# Altium project smart-ppe.PrjPcb (part 1 of 3)
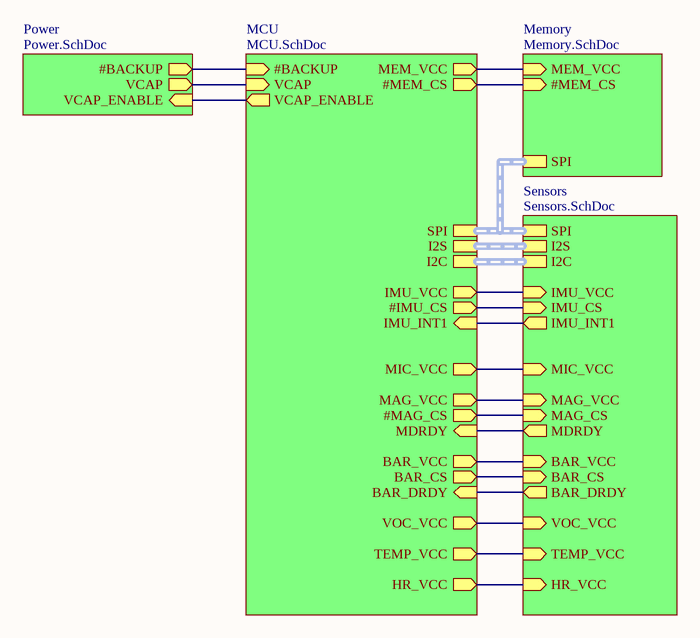
[diagram p0: Top.SchDoc]
Author: Alexander Curtiss; EmailAddress: alexander.curtiss@u.northwestern.edu; Project: Smart PPE
5 sheets, 99 parts. Net scope: hierarchical (ports join the sheet entries above them; power ports are global).
Board file: smart-ppe.PcbDoc
Sheets:
  Top.SchDoc
    MCU = MCU.SchDoc
    Memory = Memory.SchDoc
    Sensors = Sensors.SchDoc
    Power = Power.SchDoc

## Sheet Top.SchDoc: Top
size A; Author: Alexander Curtiss; DocumentNumber: 1; SheetNumber: 1; SheetTotal: 6

### Sub-sheets
MCU = MCU.SchDoc: #MEM_CS (out), MEM_VCC (out), I2S (harness MCU_I2S), IMU_VCC (out), #IMU_CS (out), IMU_INT1 (in), MIC_VCC (out), MAG_VCC (out), #MAG_CS (out), BAR_VCC (out), BAR_CS (out), BAR_DRDY (in), I2C (harness MCU_I2C), VOC_VCC (out), TEMP_VCC (out), #BACKUP (in), SPI (harness MCU_SPI), MDRDY (in), HR_VCC (out), VCAP (in), VCAP_ENABLE (out)
Memory = Memory.SchDoc: SPI (harness MCU_SPI), MEM_VCC (in), #MEM_CS (in)
Power = Power.SchDoc: #BACKUP (out), VCAP (out), VCAP_ENABLE (in)
Sensors = Sensors.SchDoc: IMU_CS (in), MAG_CS (in), IMU_INT1 (out), I2S (harness MCU_I2S), IMU_VCC (in), BAR_VCC (in), SPI (harness MCU_SPI), BAR_DRDY (out), MIC_VCC (in), MAG_VCC (in), BAR_CS (in), I2C (harness MCU_I2C), VOC_VCC (in), TEMP_VCC (in), MDRDY (out), HR_VCC (in)

### Nets
NetC10_1: sheet MCU/MEM_VCC, sheet Memory/MEM_VCC
NetC13_1: sheet MCU/MAG_VCC, sheet Sensors/MAG_VCC
NetC16_1: sheet MCU/IMU_VCC, sheet Sensors/IMU_VCC
NetC19_1: sheet MCU/MIC_VCC, sheet Sensors/MIC_VCC
NetC20_1: sheet MCU/BAR_VCC, sheet Sensors/BAR_VCC
NetC22_1: sheet MCU/TEMP_VCC, sheet Sensors/TEMP_VCC
NetC24_2: sheet MCU/VOC_VCC, sheet Sensors/VOC_VCC
NetC32_1: sheet MCU/HR_VCC, sheet Sensors/HR_VCC
NetD4_5: sheet MCU/#BACKUP, sheet Power/#BACKUP
NetQ3_2: sheet MCU/VCAP_ENABLE, sheet Power/VCAP_ENABLE
NetR18_1: sheet MCU/VCAP, sheet Power/VCAP
NetU1_10: sheet MCU/BAR_CS, sheet Sensors/BAR_CS
NetU1_12: sheet MCU/#MEM_CS, sheet Memory/#MEM_CS
NetU1_27: sheet MCU/MDRDY, sheet Sensors/MDRDY
NetU1_28: sheet MCU/#MAG_CS, sheet Sensors/MAG_CS
NetU1_30: sheet MCU/#IMU_CS, sheet Sensors/IMU_CS
NetU1_41: sheet MCU/IMU_INT1, sheet Sensors/IMU_INT1
NetU1_42: sheet MCU/BAR_DRDY, sheet Sensors/BAR_DRDY

### Buses and harness runs
harness sheet MCU/I2C = sheet Sensors/I2C
harness sheet MCU/I2S = sheet Sensors/I2S
harness sheet MCU/SPI = sheet Memory/SPI = sheet Sensors/SPI

### Notes on the sheet
- Title:
- Sheet
- of
- Project:
- Author:
- Date:
- Variant:
- Ka Moamoa
- Northwestern University
- http://kamoamoa.eecs.northwestern.edu/
- E-Mail:

## Sheet MCU.SchDoc: MCU
size A; Author: Alexander Curtiss; DocumentNumber: 2; SheetNumber: 2; SheetTotal: 6
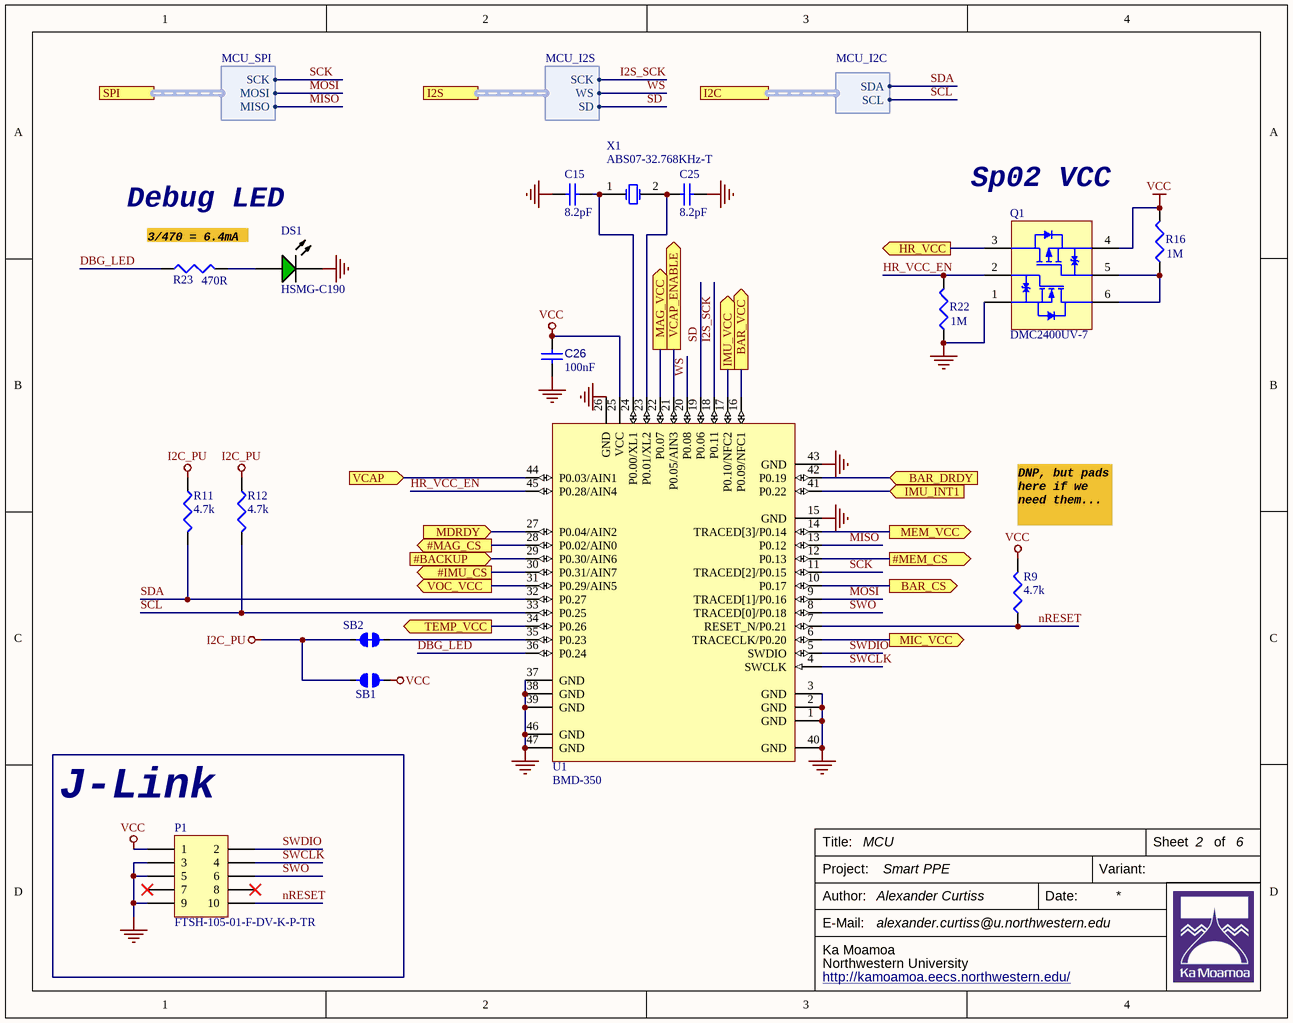
[diagram p1: MCU.SchDoc]

### Parts
C15  8.2pF  [CAPC1005X56X25NL10T15]
C25  8.2pF  [CAPC1005X56X25NL10T15]
C26  value 100nF  [CAPC0402(1005)60_L]  (hidden comment: Capacitor 100nF +/-20% 25V 0402)
DS1  HSMG-C190  [AVAG-HSMX-C190_V]
P1  FTSH-105-01-F-DV-K-P-TR  [FTSH-105-01-F-DV-K-P-TR-Footprint-1]
Q1  DMC2400UV-7  [DIOD-SOT563-6_V]
R9  4.7k  [RESC1608X55X25NL10T15]
R11  4.7k  [RESC1608X55X25NL10T15]
R12  4.7k  [RESC1608X55X25NL10T15]
R16  1M  [RESC1608X55X25NL10T15]
R22  1M  [RESC1608X55X25NL10T15]
R23  470R  [RESC1608X55X25NL10T15]
SB1  Solder Bridge  [Solder Bridge-Footprint-1]  (value not drawn)  (no BOM)
SB2  Solder Bridge NC  [Jumper NC-Footprint-1]  (value not drawn)  (net tie, no BOM)
U1  BMD-350  [BMD_LGA47S_865X640X150_CHIP]
X1  ABS07-32.768KHz-T  [ABRA-ABS07-2_V]

### Blocks framed on the sheet
J-Link: P1

### Ports
#BACKUP (in), #IMU_CS (out), #MAG_CS (out), #MEM_CS (out), BAR_CS (out), BAR_DRDY (in), BAR_VCC (out), HR_VCC (out), I2C (harness MCU_I2C), I2S (harness MCU_I2S), IMU_INT1 (in), IMU_VCC (out), MAG_VCC (out), MDRDY (in), MEM_VCC (out), MIC_VCC (out), SPI (harness MCU_SPI), TEMP_VCC (out), VCAP (in), VCAP_ENABLE (out), VOC_VCC (out)

### Harnesses
MCU_SPI: MISO, MOSI, SCK
MCU_I2S: SD, WS, SCK
MCU_I2C: SCL, SDA

### Nets
GND: C15.1 C25.1 C26.2 DS1.2(K) P1.3 P1.5 P1.9 Q1.1(S1) R22.1 U1.1(GND) U1.2(GND) U1.3(GND) U1.15(GND) U1.26(GND) U1.37(GND) U1.38(GND) U1.39(GND) U1.40(GND) U1.43(GND) U1.46(GND) U1.47(GND)
I2C_PU: R11.2 R12.2 SB1.1 SB2.1
VCC: C26.1 P1.1 Q1.4(S2) R9.2 R16.2 SB1.2 U1.25(VCC)
DBG_LED: R23.1 U1.36(P0.24)
HR_VCC_EN: Q1.2(G1) R22.2 U1.45(P0.28/AIN4)
I2S_SCK: U1.18(P0.11) ; port I2S.SCK
MISO: U1.13(P0.12) ; port SPI.MISO
MOSI: U1.9(TRACED[1]/P0.16) ; port SPI.MOSI
nRESET: P1.10 R9.1 U1.7(RESET_N/P0.21)
SCK: U1.11(TRACED[2]/P0.15) ; port SPI.SCK
SCL: R12.1 U1.33(P0.25) ; port I2C.SCL
SD: U1.19(P0.06) ; port I2S.SD
SDA: R11.1 U1.32(P0.27) ; port I2C.SDA
SWCLK: P1.4 U1.4(SWCLK)
SWDIO: P1.2 U1.5(SWDIO)
SWO: P1.6 U1.8(TRACED[0]/P0.18)
WS: U1.20(P0.08) ; port I2S.WS
NetC10_1: U1.14(TRACED[3]/P0.14) ; port MEM_VCC
NetC13_1: U1.22(P0.07) ; port MAG_VCC
NetC15_2: C15.2 U1.24(P0.00/XL1) X1.1(X1)
NetC16_1: U1.17(P0.10/NFC2) ; port IMU_VCC
NetC19_1: U1.6(TRACECLK/P0.20) ; port MIC_VCC
NetC20_1: U1.16(P0.09/NFC1) ; port BAR_VCC
NetC22_1: U1.34(P0.26) ; port TEMP_VCC
NetC24_2: U1.31(P0.29/AIN5) ; port VOC_VCC
NetC25_2: C25.2 U1.23(P0.01/XL2) X1.2(X2)
NetC32_1: Q1.3(D2) ; port HR_VCC
NetD4_5: U1.29(P0.30/AIN6) ; port #BACKUP
NetDS1_1: DS1.1(A) R23.2
NetQ1_5: Q1.5(G2) Q1.6(D1) R16.1
NetQ3_2: U1.21(P0.05/AIN3) ; port VCAP_ENABLE
NetR18_1: U1.44(P0.03/AIN1) ; port VCAP
NetSB2_2: SB2.2 U1.35(P0.23)
NetU1_10: U1.10(P0.17) ; port BAR_CS
NetU1_12: U1.12(P0.13) ; port #MEM_CS
NetU1_27: U1.27(P0.04/AIN2) ; port MDRDY
NetU1_28: U1.28(P0.02/AIN0) ; port #MAG_CS
NetU1_30: U1.30(P0.31/AIN7) ; port #IMU_CS
NetU1_41: U1.41(P0.22) ; port IMU_INT1
NetU1_42: U1.42(P0.19) ; port BAR_DRDY

Not connected (* = marked no-connect by the designer): P1 7* 8*

### Notes on the sheet
- Debug LED
- 3/470 = 6.4mA
- Sp02 VCC
- (near R9) DNP, but pads here if we need them...
- Title:
- Sheet
- of
- Project:
- Author:
- Date:
- Variant:
- Ka Moamoa
- Northwestern University
- http://kamoamoa.eecs.northwestern.edu/
- E-Mail:

### Library data of the parts
C15 C25 = CMP-2008-02690-1: Part Number: 04025A8R2JAT2A; Manufacturer: AVX Interconnect / Elco
C26 = CMP-001-00065-2: Chip Capacitor, 100nF +/-20%, 25V, 0402, Thickness 0.6 mm; Tolerance: 10%; Pins: 2; Min Operating Temperature: -55°C; Max Operating Temperature: 85°C; Mounting Technology: SMT; Case/Package: 0603; Voltage Rating: 25V
DS1 = CMP-1744-00002-1: Chip LED, Green, 2.2 V, -40 to 85 degC, 2-Pin SMD, RoHS, Tape and Reel; Frequency: 400 KHz; Max Supply Voltage: 5.5 V; Access Time: 3500 ns; Clock Frequency: 100 KHz; Case\Package: SOIC; Density: 32 kb; Nominal Supply Current: 2 mA; Interface: Serial; Min Supply Voltage: 1.7 V; Packaging: Tape and Reel; PackageReference: HSMX-C190; ComponentLink2URL: http://docs.avagotech.com/docs/AV02-0551EN; RoHSCompliant: true; Pins: 8; REACH SVHC: No SVHC; Max Operating Temperature: 85 degC; Width: 4 mm; Radiation Hardening: No; Package Quantity: 3000; ComponentLink3Description: Package Specification; ComponentLink1Description: Manufacturer URL; Min Operating Temperature: -40 degC; PackageDescription: 2-Pin Surface Mount Device, Body 1.6 x 0.8 mm, Height 0.9 mm; Max Clock Frequency: 100 KHz; Height: 1.5 mm; ComponentLink1URL: http://www.avagotech.com/; DatasheetVersion: Mar-12; ComponentLink2Description: Datasheet; Mount: Surface Mount; Length: 5 mm; ComponentLink3URL: http://www.fairchildsemi.com/dwg/MA/MA03D.pdf
P1 = CMP-00000-3: CONN HEADER SMD 10POS 1.27MM; Number of Contacts: 10; Row Spacing: 0.05inch; Connector Type: Male Pin; Housing Color: Black; Housing Material: Polymer; Min Operating Temperature: -55°C; Pitch: 1.27mm; Contact Material: Bronze; Mount: Surface Mount; Color: Black; Number of Rows: 2; Length: 6.35mm; Package Quantity: 500; Lead Free: Lead Free; Packaging: Tape and Reel; Termination: Solder; Contact Mating Length: 0.12inch; Depth: 5.84mm; Max Operating Temperature: 125°C; Contact Plating: Gold; Radiation Hardening: No; Number of Positions: 10; Orientation: Straight
Q1 = CMP-2000-06168-1: Complementary Pair Enhancement Mode MOSFET, 20 V N-Channel, -20 V P-Channel, -55 to 150 degC, 6-Pin SOTFL (SOT563), RoHS, Tape and Reel; Manufacturer: Diodes Inc; Channel Type: N,P; Maximum Power Dissipation: 1W; Typical Gate Charge @ Vgs: 0.5nC@4.5V; Typical Input Capacitance @ Vds: 37.1pF@10V; Maximum Gate Source Voltage: ±12(Q1)V,±8(Q2)V; Maximum Drain Source Resistance: 1.5Ω; Transistor Material: Si; Maximum Continuous Drain Current: 0.7A,1A; Typical Turn-Off Delay Time: 13.74ns; Number of Elements per Chip: 2; Maximum Drain Source Voltage: 20V; Maximum Gate Threshold Voltage: 1V; Transistor Configuration: Isolated; Typical Turn-On Delay Time: 4.06ns; Length: 1.7mm; Height: 0.6mm; Width: 1.25mm; Pin Count: 6; Minimum Operating Temperature: -55°C; Dimensions: 1.7x1.25x0.6mm; Package Type: SOT-563; Category: PowerMOSFET; Maximum Operating Temperature: +150°C; Manufacturer URL: http://www.diodes.com/; Channel Mode: Enhancement; Package Reference: SOT563-6; Mounting Technology: SurfaceMount; Datasheet URL: http://www.diodes.com/_files/datasheets/DMC2400UV.pdf; Package Description: 6-Pin Small Outline Transistor, Flat Lead, Body 1.175 x 1.6 mm, Pitch 0.5 mm; Mounting Type: SurfaceMount; Datasheet Version: Rev. 7-2, 06/2013
R9 R11 R12 = CMP-009-00177-2: Resistor 4.7kΩ 1% 0603; Manufacturer 1: Panasonic; Manufacturer Part Number 1: ERJ-3EKF4701V; Resistance: 4.7kR; Temperature Coefficient: 100ppm/°C; Power Rating: 100mW; Voltage Rating: 75V; Supplier 1: Digi-Key; Supplier Part Number 1: P4.70KHCT-ND; RoHS: Yes; Category: Chip SMD Resistors; Stock 1: 17388; Pricing 1: 1=0.10000, 10=0.03200, 100=0.01300, 1000=0.00583, 2500=0.00506 (USD); Mount: Surface Mount; Case/Package: 0603; Number of Pins: 2; Case Code (Metric): 1608; Case Code (Imperial): 0603; Contact Plating: Tin; Weight: 7.1E-05oz; Min Operating Temperature: -55°C; Max Operating Temperature: 155°C; Tolerance: 1%; Packaging: Tape and Reel; Resistor Type: Thick Film; Voltage Rating (DC): 75V; Number of Terminations: 2; Max Power Dissipation: 100mW; Termination: SMD/SMT; Package Quantity: 1; Features: Automotive AEC-Q200; Length: 1.6mm; Width: 0.031inch; Height: 0.022inch; Depth: 0.8mm; Radiation Hardening: No; Military Standard: Not; Lead Free: Lead Free; REACH SVHC: No SVHC; ComponentLink1URL: https://datasheet.ciiva.com/16449/aoa0000ce2-16449479.pdf?src-supplier=Future+Electronics; ComponentLink1Description: https://datasheet.ciiva.com/16449/aoa0000ce2-16449479.pdf?src-supplier=Future+Electronics; ComponentLink2URL: https://datasheet.ciiva.com/9195/aoa0000ce2-9195740.pdf?src-supplier=Avnet; ComponentLink2Description: https://datasheet.ciiva.com/9195/aoa0000ce2-9195740.pdf?src-supplier=Avnet; ComponentLink3URL: https://datasheet.ciiva.com/16758/70260748-16758189.pdf?src-supplier=Allied+Electronics; ComponentLink3Description: https://datasheet.ciiva.com/16758/70260748-16758189.pdf?src-supplier=Allied+Electronics; ComponentLink4URL: https://datasheet.ciiva.com/24160/aoa0000ce2-24160445.pdf?src-supplier=Mouser; ComponentLink4Description: https://datasheet.ciiva.com/24160/aoa0000ce2-24160445.pdf?src-supplier=Mouser; ComponentLink5URL: https://datasheet.ciiva.com/46372/1678782-46372717.pdf?src-supplier=Element14; ComponentLink5Description: https://datasheet.ciiva.com/46372/1678782-46372717.pdf?src-supplier=Element14; ComponentLink6URL: https://datasheet.ciiva.com/7830/aoa0000ce2-7830735.pdf?src-supplier=Element14; ComponentLink6Description: https://datasheet.ciiva.com/7830/aoa0000ce2-7830735.pdf?src-supplier=Element14; ComponentLink7URL: https://datasheet.ciiva.com/16511/aoa0000ce2-16511783.pdf?src-supplier=Avnet+Asia; ComponentLink7Description: https://datasheet.ciiva.com/16511/aoa0000ce2-16511783.pdf?src-supplier=Avnet+Asia; ComponentLink8URL: https://datasheet.ciiva.com/7830/426256-7830985.pdf?src-supplier=Element14; ComponentLink8Description: https://datasheet.ciiva.com/7830/426256-7830985.pdf?src-supplier=Element14; ComponentLink9URL: https://datasheet.ciiva.com/46372/1678782-46372716.pdf?src-supplier=Element14; ComponentLink9Description: https://datasheet.ciiva.com/46372/1678782-46372716.pdf?src-supplier=Element14; ComponentLink10URL: https://datasheet.ciiva.com/17213/aoa0000ce2-17213182.pdf?src-supplier=Avnet+Europe; ComponentLink10Description: https://datasheet.ciiva.com/17213/aoa0000ce2-17213182.pdf?src-supplier=Avnet+Europe
R16 R22 = CMP-009-00177-2: Resistor =Value =Tolerance 0603; Manufacturer 1: Vishay; Manufacturer Part Number 1: CRCW06031M00FKEA; Tolerance: 1%; Resistance: 1MR; Temperature Coefficient: 100ppm/°C; Power Rating: 100mW; Voltage Rating: 75V; Supplier 1: Digi-Key; Supplier Part Number 1: 541-1.00MHCT-ND; RoHS: Yes; Category: Chip SMD Resistors; Stock 1: 268304; Pricing 1: 1=0.10000, 10=0.03100, 100=0.01260, 1000=0.00567, 2500=0.00492 (USD); Mount: Surface Mount; Case/Package: 0603; Number of Pins: 2; Case Code (Imperial): 0603; Case Code (Metric): 1608; Contact Plating: Tin; Weight: 7.1E-05oz; Min Operating Temperature: -55°C; Max Operating Temperature: 155°C; Packaging: Tape and Reel; Resistor Type: Thick Film; Number of Terminations: 2; Package Quantity: 10; Max Power Dissipation: 100mW; Termination: SMD/SMT; Features: Automotive AEC-Q200; Voltage Rating (DC): 75V; Length: 1.55mm; Width: 0.85mm; Height: 0.45mm; Depth: 0.85mm; Radiation Hardening: No; Lead Free: Lead Free; Military Standard: Not; REACH SVHC: Unknown; ComponentLink1URL: https://datasheet.ciiva.com/11809/0900766b80d98afc-11809074.pdf?src-supplier=RSComponents; ComponentLink1Description: https://datasheet.ciiva.com/11809/0900766b80d98afc-11809074.pdf?src-supplier=RSComponents; ComponentLink2URL: https://datasheet.ciiva.com/16311/dcrcwe3-16311533.pdf?src-supplier=Future+Electronics; ComponentLink2Description: https://datasheet.ciiva.com/16311/dcrcwe3-16311533.pdf?src-supplier=Future+Electronics; ComponentLink3URL: https://datasheet.ciiva.com/7841/125364-7841823.pdf?src-supplier=Element14; ComponentLink3Description: https://datasheet.ciiva.com/7841/125364-7841823.pdf?src-supplier=Element14; ComponentLink4URL: https://datasheet.ciiva.com/26314/fld-crcw-e3-data-en-26314645.pdf?src-supplier=Distrelec; ComponentLink4Description: https://datasheet.ciiva.com/26314/fld-crcw-e3-data-en-26314645.pdf?src-supplier=Distrelec; ComponentLink5URL: https://datasheet.ciiva.com/2465/dcrcwe3-2465549.pdf?src-supplier=Digi-Key; ComponentLink5Description: https://datasheet.ciiva.com/2465/dcrcwe3-2465549.pdf?src-supplier=Digi-Key; ComponentLink6URL: https://datasheet.ciiva.com/2465/dcrcwe3-2465550.pdf?src-supplier=Digi-Key; ComponentLink6Description: https://datasheet.ciiva.com/2465/dcrcwe3-2465550.pdf?src-supplier=Digi-Key; ComponentLink7URL: https://datasheet.ciiva.com/7841/1720486-7841822.pdf?src-supplier=Element14; ComponentLink7Description: https://datasheet.ciiva.com/7841/1720486-7841822.pdf?src-supplier=Element14; ComponentLink8URL: https://datasheet.ciiva.com/2465/dcrcwe3-2465551.pdf?src-supplier=Digi-Key; ComponentLink8Description: https://datasheet.ciiva.com/2465/dcrcwe3-2465551.pdf?src-supplier=Digi-Key
R23 = CMP-009-00177-2: Resistor 470Ω 1% 0603; Manufacturer 1: Panasonic; Manufacturer Part Number 1: ERJ3EKF4700V; Temperature Coefficient: 100ppm/°C; Power Rating: 100mW; Voltage Rating: 75V; Supplier 1: Digi-Key; Supplier Part Number 1: P470HCT-ND; RoHS: Yes; Category: Chip SMD Resistors; Stock 1: 57256; Pricing 1: 1=0.10000, 10=0.03200, 100=0.01300, 1000=0.00583, 2500=0.00506 (USD); Mount: Surface Mount; Case/Package: 0603; Number of Pins: 2; Case Code (Metric): 1608; Case Code (Imperial): 0603; Contact Plating: Tin; Min Operating Temperature: -55°C; Max Operating Temperature: 155°C; Packaging: Tape and Reel; Resistance: 470R; Tolerance: 1%; Termination: SMD/SMT; Package Quantity: 5000; Resistor Type: Thick Film; Number of Terminations: 2; Max Power Dissipation: 100mW; Features: Automotive AEC-Q200; Voltage Rating (DC): 75V; Length: 1.6mm; Width: 0.8mm; Height: 0.45mm; Depth: 0.8mm; Radiation Hardening: No; Lead Free: Lead Free; REACH SVHC: No SVHC; Military Standard: Not; ComponentLink1URL: https://datasheet.ciiva.com/16440/aoa0000ce2-16440182.pdf?src-supplier=Future+Electronics; ComponentLink1Description: https://datasheet.ciiva.com/16440/aoa0000ce2-16440182.pdf?src-supplier=Future+Electronics; ComponentLink2URL: https://datasheet.ciiva.com/6138/aoa0000ce2-6138151.pdf?src-supplier=Farnell; ComponentLink2Description: https://datasheet.ciiva.com/6138/aoa0000ce2-6138151.pdf?src-supplier=Farnell; ComponentLink3URL: https://datasheet.ciiva.com/15159/getdatasheetpartid-45800-15159559.pdf?src-supplier=Verical; ComponentLink3Description: https://datasheet.ciiva.com/15159/getdatasheetpartid-45800-15159559.pdf?src-supplier=Verical; ComponentLink4URL: https://datasheet.ciiva.com/22687/1678782-22687447.pdf?src-supplier=Element14; ComponentLink4Description: https://datasheet.ciiva.com/22687/1678782-22687447.pdf?src-supplier=Element14; ComponentLink5URL: https://datasheet.ciiva.com/7830/426256-7830984.pdf?src-supplier=Element14; ComponentLink5Description: https://datasheet.ciiva.com/7830/426256-7830984.pdf?src-supplier=Element14; ComponentLink6URL: https://datasheet.ciiva.com/46372/1678782-46372969.pdf?src-supplier=Element14; ComponentLink6Description: https://datasheet.ciiva.com/46372/1678782-46372969.pdf?src-supplier=Element14; ComponentLink7URL: https://datasheet.ciiva.com/46372/1678782-46372970.pdf?src-supplier=Element14; ComponentLink7Description: https://datasheet.ciiva.com/46372/1678782-46372970.pdf?src-supplier=Element14; ComponentLink8URL: https://datasheet.ciiva.com/16784/70260748-16784891.pdf?src-supplier=Allied+Electronics; ComponentLink8Description: https://datasheet.ciiva.com/16784/70260748-16784891.pdf?src-supplier=Allied+Electronics; ComponentLink9URL: https://datasheet.ciiva.com/17205/aoa0000ce2-17205548.pdf?src-supplier=Avnet+Europe; ComponentLink9Description: https://datasheet.ciiva.com/17205/aoa0000ce2-17205548.pdf?src-supplier=Avnet+Europe; ComponentLink10URL: https://datasheet.ciiva.com/16773/70260748-16773597.pdf?src-supplier=Allied+Electronics; ComponentLink10Description: https://datasheet.ciiva.com/16773/70260748-16773597.pdf?src-supplier=Allied+Electronics; ComponentLink11URL: https://datasheet.ciiva.com/7830/aoa0000ce2-7830734.pdf?src-supplier=Element14; ComponentLink11Description: https://datasheet.ciiva.com/7830/aoa0000ce2-7830734.pdf?src-supplier=Element14; ComponentLink12URL: https://datasheet.ciiva.com/24069/aoa0000ce2-24069535.pdf?src-supplier=Mouser; ComponentLink12Description: https://datasheet.ciiva.com/24069/aoa0000ce2-24069535.pdf?src-supplier=Mouser
SB1 = CMP-009-00179-1: Normally open solder jumper
SB2 = CMP-009-00178-4: Normally closed solder jumper
U1 = CMP-003-0015-1: u-blox BMD-350 Bluetooth 5 module; Manufacturer P/N: BMD-350-A-R; Body Size: 8.65mm x 6.4mm; Internal Antenna: CHIP; Protocol: BT 5 LE, 2.4GHz Proprietary; Part Number: BMD-350; Manufacturer: u-blox; Design Item ID: BMD-350; Height: 1.5mm; Source: ubloxLib.SchLib
X1 = CMP-0447-00001-2: Crystal, 32.768 kHz, 12.5 pF, -40 to 85 degC, SMD Low Profile 3.2 x 1.5 x 0.9 mm, Tape and Reel; Manufacturer: Abracon; Q Value (Type): 30000; Operation Mode: Flexural Mode (Tuning Fork); Shunt Capacitance (C0): 0.9 to 1.2 pF; Load Capacitance (CL): 12.5 pF; Frequency Tolerance @+25degC: +/- 20 ppm; Drive Level (Type): 0.1 uW; Equivalent Series Resistance (R1): 70 Kohm; Insulation Resistance (Min): 500 Mohm; ComponentLink3URL: http://www.abracon.com/Resonators/ABS07.pdf; PackageDescription: 2-Pin Hand Drawn, Body 3.2x1.5mm, Pitch 2.5mm; Operating Temperature: -40 to 85 degC; ComponentLink2URL: http://www.abracon.com/Resonators/ABS07.pdf; PackageReference: ABS07-2; ComponentLink3Description: Package Specification; ComponentLink1Description: Manufacturer URL; DatasheetVersion: 04.03.13; Mounting Technology: Surface Mount; ComponentLink2Description: Datasheet; ComponentLink1URL: http://www.abracon.com/; PartNumber: ABS07-32.768KHz-T; Packing: Tape and Reel; Frequency: 32.768 kHz

## Sheet Memory.SchDoc: Memory
size A; Author: Alexander Curtiss; DocumentNumber: 5; SheetNumber: 5; SheetTotal: 6
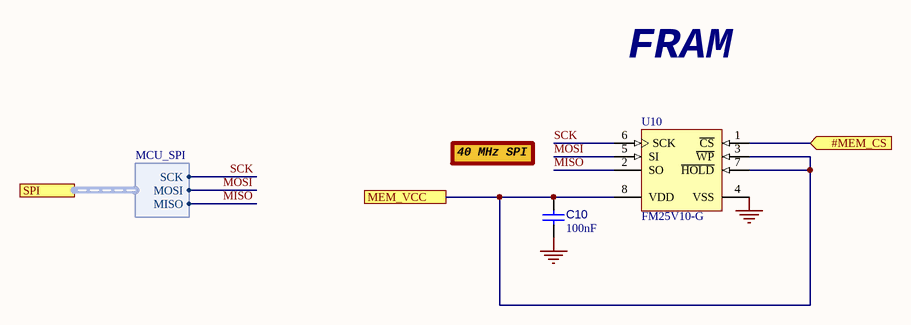
[diagram p2: Memory.SchDoc]

### Parts
C10  value 100nF  [CAPC0402(1005)60_L]  (hidden comment: Capacitor 100nF +/-20% 25V 0402)
U10  FM25V10-G  [SOIC127P600X173-8N]

### Ports
#MEM_CS (in), MEM_VCC, SPI (harness MCU_SPI)

### Harnesses
MCU_SPI: MISO, MOSI, SCK

### Nets
GND: C10.2 U10.4(VSS)
MISO: U10.2(SO) ; port SPI.MISO
MOSI: U10.5(SI) ; port SPI.MOSI
SCK: U10.6(SCK) ; port SPI.SCK
NetC10_1: C10.1 U10.3(~{WP}) U10.7(~{HOLD}) U10.8(VDD) ; port MEM_VCC
NetU1_12: U10.1(~{CS}) ; port #MEM_CS

### Notes on the sheet
- FRAM
- (near C10) 40 MHz SPI
- Title:
- Sheet
- of
- Project:
- Author:
- Date:
- Variant:
- Ka Moamoa
- Northwestern University
- http://kamoamoa.eecs.northwestern.edu/
- E-Mail:

### Library data of the parts
C10 = CMP-001-00065-2: as C26 on sheet MCU; Pins: 2; Min Operating Temperature: -55°C; Max Operating Temperature: 85°C; Mounting Technology: SMT; Case/Package: 0603; Voltage Rating: 25V
U10 = CMP-00002-2: 1-Mbit Serial F-RAM, 2 to 3.6 V, -40 to 85 degC, 8-Pin SOIC (S08.15), RoHS, Tube; Memory Size: 1 Mbits; Supply Voltage Min: 2 V; Access Time: 18 ns; Supply Voltage Max: 3.6 V; Packing: Tube; Code_JEDEC: MS-012; ComponentLink1Description: Manufacturer URL; ComponentLink2URL: http://www.cypress.com/file/41691/download; ComponentLink3Description: Package Specification; PackageDescription: 8-Pin SOIC, Body 4.9 x 3.9 mm, Pitch 1.27 mm; ComponentLink3URL: http://www.mill-max.com/assets/pdfs/metric/007M.PDF; Temperature Min: -40 degC; DatasheetVersion: Rev. *F; Temperature Max: 85 degC; ComponentLink2Description: Datasheet; ComponentLink1URL: http://www.cypress.com/; PartNumber: FM25V10-G; Mounting Technology: Surface Mount; PackageVersion: Rev. *D, 12/2009; Generic Part Number: FM25V10; RoHS: TRUE

## Sheet Sensors.SchDoc: Sensors
size B; Author: Alexander Curtiss; DocumentNumber: 4; SheetNumber: 4; SheetTotal: 6
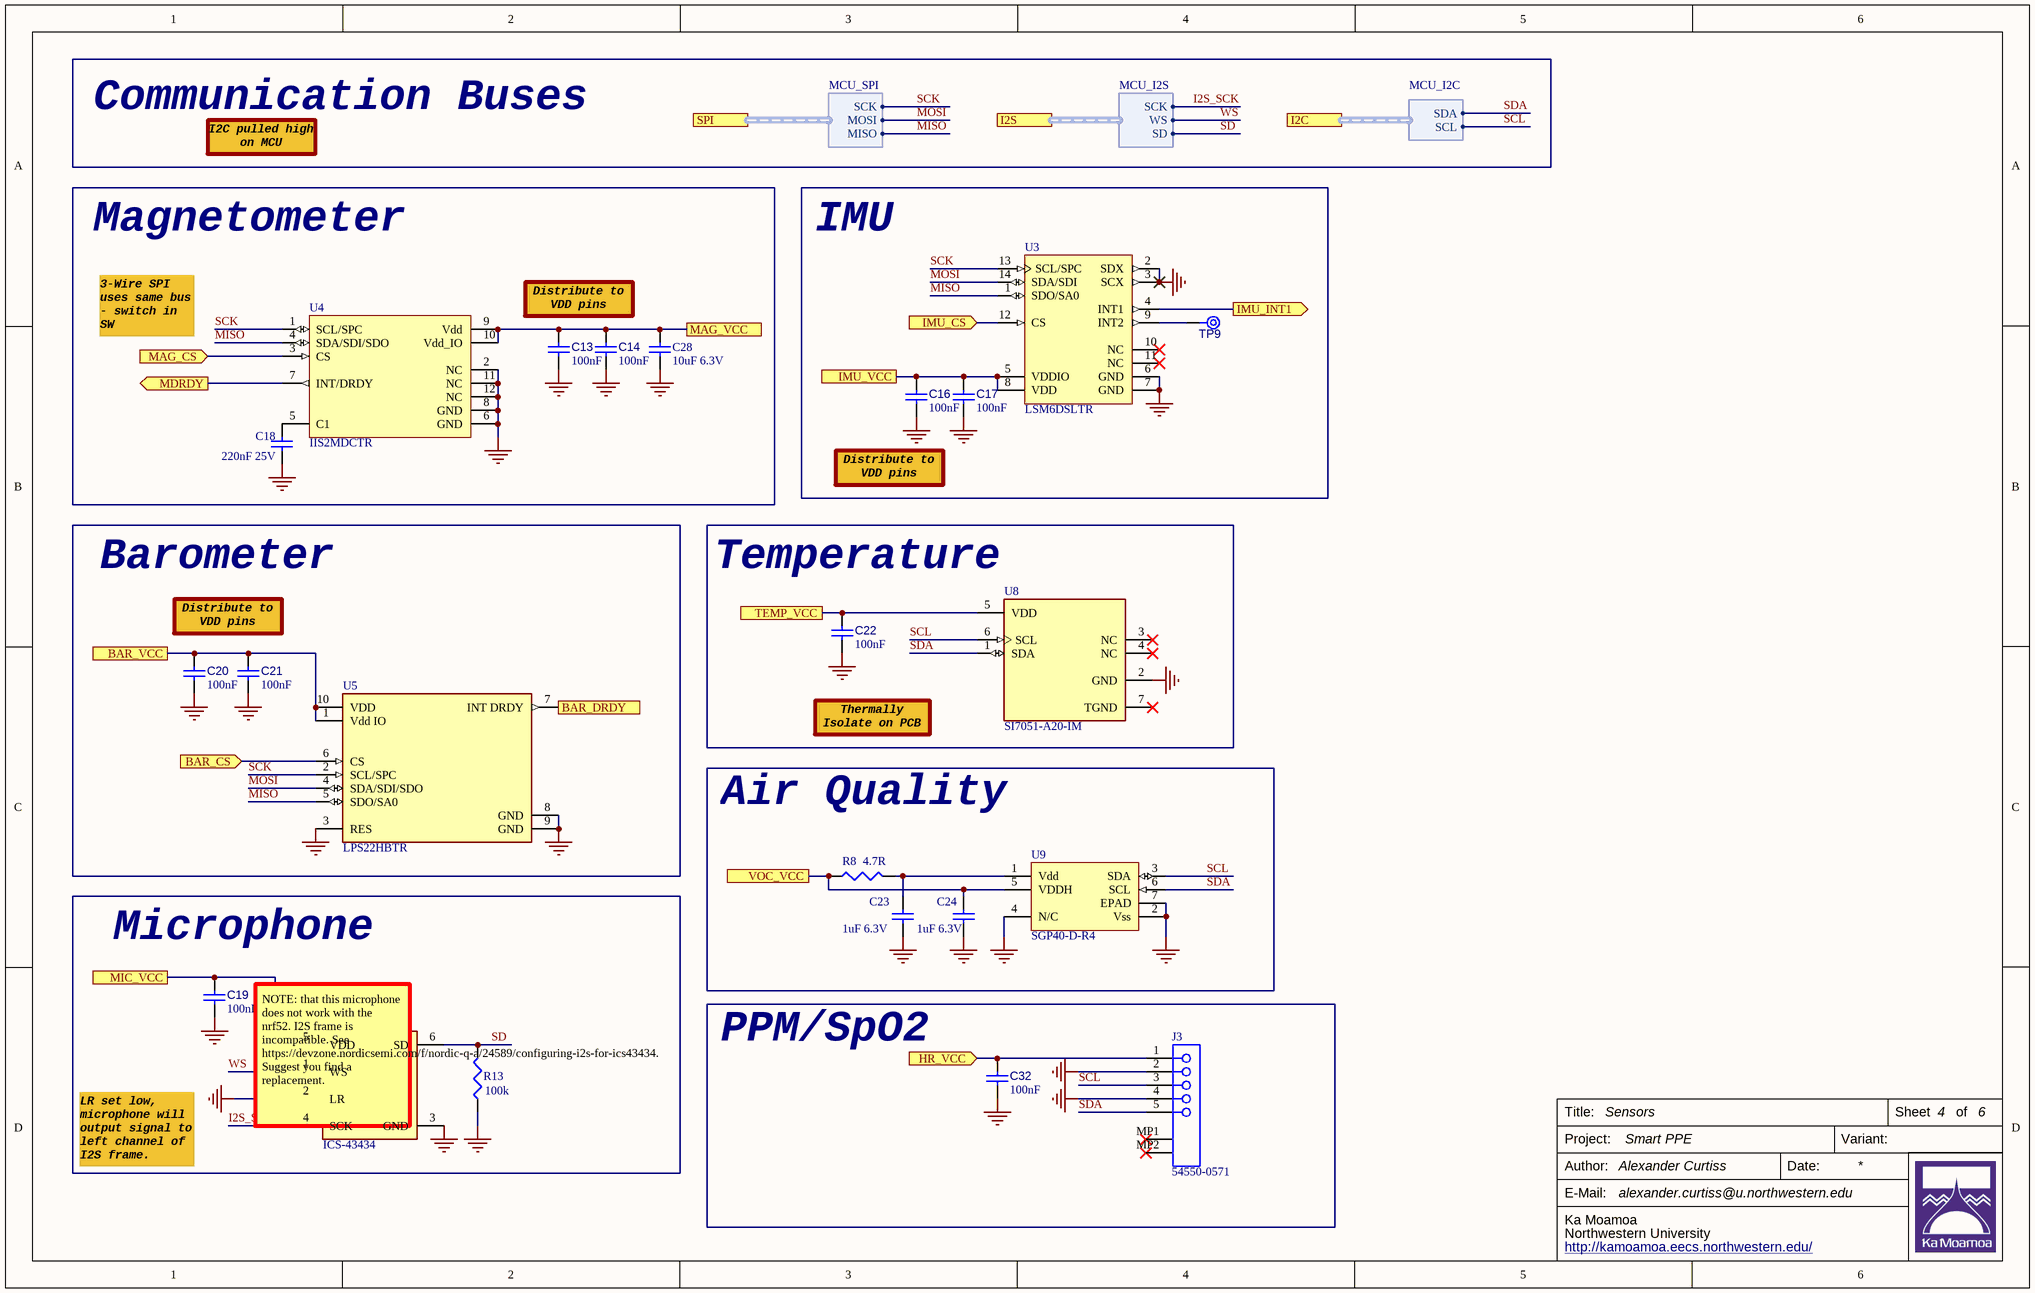
[diagram p3: Sensors.SchDoc]

### Parts
C13  value 100nF  [CAPC0402(1005)60_L]  (hidden comment: Capacitor 100nF +/-20% 25V 0402)
C14  value 100nF  [CAPC0402(1005)60_L]  (hidden comment: Capacitor 100nF +/-20% 25V 0402)
C16  value 100nF  [CAPC0402(1005)60_L]  (hidden comment: Capacitor 100nF +/-20% 25V 0402)
C17  value 100nF  [CAPC0402(1005)60_L]  (hidden comment: Capacitor 100nF +/-20% 25V 0402)
C18  220nF 25V  [CAPC0603(1608)100_N]
C19  value 100nF  [CAPC0402(1005)60_L]  (hidden comment: Capacitor 100nF +/-20% 25V 0402)
C20  value 100nF  [CAPC0402(1005)60_L]  (hidden comment: Capacitor 100nF +/-20% 25V 0402)
C21  value 100nF  [CAPC0402(1005)60_L]  (hidden comment: Capacitor 100nF +/-20% 25V 0402)
C22  value 100nF  [CAPC0402(1005)60_L]  (hidden comment: Capacitor 100nF +/-20% 25V 0402)
C23  1uF 6.3V  [CAPC1005X55X25ML5T10]
C24  1uF 6.3V  [CAPC1005X55X25ML5T10]
C28  10uF 6.3V  [CAPC1608X90X35NL10T15]
C32  value 100nF  [CAPC0402(1005)60_L]  (hidden comment: Capacitor 100nF +/-20% 25V 0402)
J3  54550-0571  [MOLX-54550-0571]
MK1  Part Number: ICS-43434  [InvenSense_ICS-43434_0]  (hidden comment: Mic_InvenSense_ICS-43434_eec)
R8  4.7R  [RESC1608X55X25NL10T15]
R13  100k  [RESC1608X55X25NL10T15]
TP9  VSTOR  [TP06R]  (value not drawn)  (no BOM)
U3  LSM6DSLTR  [STM-LGA-14_2500X3000X860]
U4  IIS2MDCTR  [LSM6DSLTR]
U5  LPS22HBTR  [FP-HLGA-10L-8479831-0]
U8  SI7051-A20-IM  [FP-SI7051-A20-IM-MFG]
U9  SGP40-D-R4  [SGP40-D-R4]

### Blocks framed on the sheet
Magnetometer: C13 C14 C18 C28 U4
IMU: C16 C17 TP9 U3
Barometer: C20 C21 U5
Temperature: C22 U8
Air Quality: C23 C24 R8 U9
Microphone: C19 MK1 R13
PPM/SpO2: C32 J3

### Ports
BAR_CS (in), BAR_DRDY (out), BAR_VCC, HR_VCC (in), I2C (harness MCU_I2C), I2S (harness MCU_I2S), IMU_CS (in), IMU_INT1 (out), IMU_VCC, MAG_CS (in), MAG_VCC, MDRDY (out), MIC_VCC, SPI (harness MCU_SPI), TEMP_VCC, VOC_VCC

### Harnesses
MCU_SPI: MISO, MOSI, SCK
MCU_I2S: SD, WS, SCK
MCU_I2C: SCL, SDA

### Nets
GND: C13.2 C14.2 C16.2 C17.2 C18.1 C19.2 C20.2 C21.2 C22.2 C23.1 C24.1 C28.1 C32.2 J3.2 J3.4 MK1.2(LR) MK1.3(GND) R13.1 U3.2(SDX) U3.3(SCX) U3.6(GND) U3.7(GND) U4.2(NC) U4.6(GND) U4.8(GND) U4.11(NC) U4.12(NC) U5.3(RES) U5.8(GND) U5.9(GND) U8.2(GND) U9.2(Vss) U9.4(N/C) U9.7(EPAD)
I2S_SCK: MK1.4(SCK) ; port I2S.SCK
MISO: U3.1(SDO/SA0) U4.4(SDA/SDI/SDO) U5.5(SDO/SA0) ; port SPI.MISO
MOSI: U3.14(SDA/SDI) U5.4(SDA/SDI/SDO) ; port SPI.MOSI
SCK: U3.13(SCL/SPC) U4.1(SCL/SPC) U5.2(SCL/SPC) ; port SPI.SCK
SCL: J3.3 U8.6(SCL) U9.3(SDA) ; port I2C.SCL
SD: MK1.6(SD) R13.2 ; port I2S.SD
SDA: J3.5 U8.1(SDA) U9.6(SCL) ; port I2C.SDA
WS: MK1.1(WS) ; port I2S.WS
NetC13_1: C13.1 C14.1 C28.2 U4.9(Vdd) U4.10(Vdd_IO) ; port MAG_VCC
NetC16_1: C16.1 C17.1 U3.5(VDDIO) U3.8(VDD) ; port IMU_VCC
NetC18_2: C18.2 U4.5(C1)
NetC19_1: C19.1 MK1.5(VDD) ; port MIC_VCC
NetC20_1: C20.1 C21.1 U5.1(Vdd_IO) U5.10(VDD) ; port BAR_VCC
NetC22_1: C22.1 U8.5(VDD) ; port TEMP_VCC
NetC23_2: C23.2 R8.2 U9.1(Vdd)
NetC24_2: C24.2 R8.1 U9.5(VDDH) ; port VOC_VCC
NetC32_1: C32.1 J3.1 ; port HR_VCC
NetTP9_1: TP9.1(TP) U3.9(INT2)
NetU1_10: U5.6(CS) ; port BAR_CS
NetU1_27: U4.7(INT/DRDY) ; port MDRDY
NetU1_28: U4.3(CS) ; port MAG_CS
NetU1_30: U3.12(CS) ; port IMU_CS
NetU1_41: U3.4(INT1) ; port IMU_INT1
NetU1_42: U5.7(INT_DRDY) ; port BAR_DRDY

Not connected (* = marked no-connect by the designer): J3 MP1* MP2*; U3 10(NC)* 11(NC)*; U8 3(NC)* 4(NC)* 7(TGND)*

### Notes on the sheet
- Communication Buses
- I2C pulled high on MCU
- 3-Wire SPI uses same bus - switch in SW
- Distribute to VDD pins
- Thermally Isolate on PCB
- LR set low, microphone will output signal to left channel of I2S frame.
- (near MK1) NOTE: that this microphone does not work with the nrf52. I2S frame is incompatible. See https://devzone.nordicsemi.com/f/nordic-q-a/24589/configuring-i2s-for-ics43434. Suggest you find a replacement.
- Title:
- Sheet
- of
- Project:
- Author:
- Date:
- Variant:
- Ka Moamoa
- Northwestern University
- http://kamoamoa.eecs.northwestern.edu/
- E-Mail:

### Library data of the parts
C13 C14 C16 C17 C19-C22 C32 = CMP-001-00065-2: as C26 on sheet MCU; Pins: 2; Min Operating Temperature: -55°C; Max Operating Temperature: 85°C; Mounting Technology: SMT; Case/Package: 0603; Voltage Rating: 25V
C18 = CMP-1035-02648-1: CAP 220nF 25V ±10% 0603 (1608 Metric) Thickness 1mm SMD; Tolerance: Â±10%; Case-Metric: 1608; Case-EIA: 0603; Value: 220nF; Rated Voltage: 25 V; Technology: SMT; Max Thickness: 1 mm
C23 C24 = CMP-2100-03591-1: Chip Capacitor, 1 uF, +/- 10%, 6.3 V, -55 to 85 degC, 1005 (0402 Metric), RoHS, Tape and Reel; Manufacturer: Yageo; Dielectric: X5R; Dielectric Material: Ceramic; Number of Pins: 2; Lead Free: LeadFree; Voltage Rating (DC): 6.3V; RoHSCompliant: True; Manufacturer URL: http://www.yageo.com/; Package Reference: 0402; REACH SVHC: NoSVHC; Tolerance: 10%; Case Code (Imperial): 0402; Width: 0.02inch; Case Code (Metric): 1005; Thickness: 0.022inch; Packaging: TapeandReel; Voltage Rating: 6.3V; Case/Package: 0402; Depth: 0.5mm; Max Operating Temperature: 85degC; Datasheet URL: http://www.yageo.com/documents/recent/UPY-GPHC_X5R_4V-to-50V_22.pdf; Composition: Ceramic; Length: 1mm; Radiation Hardening: No; Capacitance: 1uF; Height: 0.5mm; Mount: SurfaceMount; Datasheet Version: Rev. 22, 10/2016; Package Quantity: 1; Package Description: 2-Pin Surface Mount Device, Body 1 x 0.5 mm; Termination: SMD/SMT; Min Operating Temperature: -55degC
C28 = CMP-2006-02792-1: Part Number: GRM188R60J106ME47D; Manufacturer: Murata
J3 = CMP-1241-00559-1: 0.5 mm Pitch Easy-On(TM) Type FPC Connector, 1.2 mm Mated Height, Right Angle, ZIF, SMT, Top Contact, 5 Circuits, -20 to 85 degC, ELV and RoHS Compliant, Tape and Reel; Manufacturer: Molex; Stackable: No; Pitch - Mating Interface: 0.50mm; Mated Height: 1.20mm; Voltage (Max): 50V; Durability (mating cycles max): 20; Entry Angle: 90degrees Angle; Material - Plating Termination: Tin; Current (Max per Contact): 0.5A; Material - Metal: Phosphor Bronze; Material - Plating Mating: Gold; Polarized to PCB: Yes; Circuits (Loaded): 5; ComponentLink2URL: http://www.molex.com/webdocs/datasheets/pdf/en-us/0545500571_FFC_FPC_CONNECTORS.pdf; Orientation: Right Angle; ComponentLink1Description: Manufacturer URL; ComponentLink1URL: http://www.molex.com/molex/index.jsp; Mounting Technology: Surface Mount; Packing: Tape and Reel; RoHS: TRUE; Number of Rows: 1; PartNumber: 54550-0571; PackageReference: 54550-0571; ComponentLink3URL: http://www.molex.com/pdm_docs/sd/545500571_sd.pdf; PackageDescription: 5-Lead FPC Connector, Pitch 0.5 mm; ComponentLink2Description: Datasheet; PCB Retention: Yes; PackageVersion: Rev. M, 12/2009; Contact Position: Top; PCB Locator: No; ComponentLink3Description: Package Specification
MK1 = CMP-008-0000-1: MIC MEMS MULTI-MODE OMNI -26DB; Price: 2.41535279224; Design Item ID: Mic_InvenSense_ICS-43434_eec; ComponentLink2URL: https://www.invensense.com/wp-content/uploads/2016/02/DS-000069-ICS-43434-v1.1.pdf; Package: MIC_SMT_2MM65_3MM5; ComponentLink2Description: Datasheet; Lead Free: yes; Source: Mic_InvenSense_ICS-43434_eec.SchLib; Digikey Description: MIC MEMS MULTI-MODE OMNI -26DB; helpURL: https://upverter.com/upn/revision/74e8235c14aaa9d1/; ComponentLink1Description: Upverter; RoHS: TRUE; Digikey Part Number: 1428-1066-1-ND; Temperature Range High: +85°C; Temperature: − 40°C to +85°C; Manufacturer: InvenSense; Temperature Range Low: − 40°C; ComponentLink1URL: https://upverter.com/upn/revision/74e8235c14aaa9d1/
R8 = CMP-009-00177-2: Resistor 4.7Ω 1% 0603; Manufacturer 1: Yageo; Manufacturer Part Number 1: RC0603FR-074R7L; Voltage Rating: 50V; Power Rating: 100mW; Temperature Coefficient: 200ppm/°C; Supplier 1: Digi-Key; Supplier Part Number 1: YAG3371CT-ND; RoHS: Yes; Category: Chip SMD Resistors; Stock 1: 443175; Pricing 1: 1=0.10000, 10=0.04200, 100=0.01710, 1000=0.00766, 2500=0.00665 (USD); Case/Package: 0603; Number of Pins: 2; Case Code (Imperial): 0603; Case Code (Metric): 1608; Min Operating Temperature: -55°C; Max Operating Temperature: 155°C; Package Quantity: 5000; Resistance: 4.7R; Tolerance: 1%; Packaging: Tape and Reel; Voltage Rating (DC): 50V; Resistor Type: Thick Film; Number of Terminations: 2; Termination: SMD/SMT; Max Power Dissipation: 100mW; Features: Moisture Resistant; Length: 1.6mm; Width: 0.8mm; Height: 0.45mm; Depth: 0.8mm; REACH SVHC: Unknown; Lead Free: Lead Free; ComponentLink1URL: https://datasheet.ciiva.com/46440/1868787-46440910.pdf?src-supplier=Element14; ComponentLink1Description: https://datasheet.ciiva.com/46440/1868787-46440910.pdf?src-supplier=Element14; ComponentLink2URL: https://datasheet.ciiva.com/12555/rc0603-272842-12555071.pdf?src-supplier=Mouser; ComponentLink2Description: https://datasheet.ciiva.com/12555/rc0603-272842-12555071.pdf?src-supplier=Mouser
R13 = CMP-009-00177-2: Resistor 100kΩ 1% 0603; Manufacturer 1: Yageo; Manufacturer Part Number 1: RC0603FR-07100KL; Resistance: 100kR; Power Rating: 100mW; Temperature Coefficient: 100ppm/°C; Voltage Rating: 50V; Working Voltage: 75V; Supplier 1: Digi-Key; Supplier Part Number 1: 311-100KHRCT-ND; RoHS: Yes; Category: Chip SMD Resistors; Stock 1: 11096179; Pricing 1: 1=0.10000, 10=0.02100, 100=0.00850, 1000=0.00382, 2500=0.00331 (USD); Case/Package: 0603; Number of Pins: 2; Case Code (Imperial): 0603; Case Code (Metric): 1608; Min Operating Temperature: -55°C; Max Operating Temperature: 155°C; Packaging: Tape and Reel; Tolerance: 1%; Resistor Type: Thick Film; Termination: SMD/SMT; Number of Terminations: 2; Voltage Rating (DC): 50V; Length: 1.6mm; Width: 0.8mm; Height: 0.45mm; Depth: 0.8mm; Military Standard: Not; REACH SVHC: No SVHC; Lead Free: Lead Free; ComponentLink1URL: https://datasheet.ciiva.com/11808/0900766b80f96399-11808107.pdf?src-supplier=RSComponents; ComponentLink1Description: https://datasheet.ciiva.com/11808/0900766b80f96399-11808107.pdf?src-supplier=RSComponents; ComponentLink2URL: https://datasheet.ciiva.com/7983/443971-7983593.pdf?src-supplier=Element14; ComponentLink2Description: https://datasheet.ciiva.com/7983/443971-7983593.pdf?src-supplier=Element14; ComponentLink3URL: https://datasheet.ciiva.com/46440/1868787-46440889.pdf?src-supplier=Element14; ComponentLink3Description: https://datasheet.ciiva.com/46440/1868787-46440889.pdf?src-supplier=Element14; ComponentLink4URL: https://datasheet.ciiva.com/7746/1738695-7746234.pdf?src-supplier=Element14; ComponentLink4Description: https://datasheet.ciiva.com/7746/1738695-7746234.pdf?src-supplier=Element14; ComponentLink5URL: https://datasheet.ciiva.com/7746/1738695-7746235.pdf?src-supplier=Element14; ComponentLink5Description: https://datasheet.ciiva.com/7746/1738695-7746235.pdf?src-supplier=Element14; ComponentLink6URL: https://datasheet.ciiva.com/22747/443971-22747516.pdf?src-supplier=Element14; ComponentLink6Description: https://datasheet.ciiva.com/22747/443971-22747516.pdf?src-supplier=Element14
TP9 = CMP-00028-00002-2: 0.6mm round test point; Pins: 1
U3 = CMP-2000-07467-1: iNEMO Inertial Module:Always-on 3D Accelerometer and 3D Gyroscope, 1.71 to 3.6 V, -40 to 85 degC, 14-Pin LGA, RoHS, Tape and Reel; Manufacturer: STMicroelectronics; Datasheet URL: http://www.st.com/content/ccc/resource/technical/document/datasheet/ee/23/a0/dc/1d/68/45/52/DM00237456.pdf/files/DM00237456.pdf/jcr:content/translations/en.DM00237456.pdf; Mounting Technology: SurfaceMount; Datasheet Version: Rev. 6, 05/2017; RoHSCompliant: false; Package Reference: LGA-14_2500X3000X860; Manufacturer URL: http://www.st.com/; Package Description: 12-Pin Land Grid Array Package, Body 2.5 x 3 mm, Pitch 0.5 mm
U4 = CMP-010-00024-3: HIGH ACCURACY ULTRA-LOW-POWER 3-; Axis: X, Y, Z; Resolution: 16b; Sensing Method: Magnetoresistive; Output Type: SPI,I2C; Case/Package: LGA; Max Operating Temperature: 85°C; Packaging: Cut Tape; Number of Pins: 12; Min Operating Temperature: -40°C
U5 = CMP-12182-000004-1: MEMS NANO PRESSURE SENSOR: 260-1; Manufacturer: STMicroelectronics; Sensor Output: I2C,SPI; Port Style: No Port; Max Supply Voltage: 3.6V; Operating Supply Current: 3-12uA; Min Supply Voltage: 1.7V; Device Class L3: unset; Device Class L1: Sensors; Manufacturer Part Number: LPS22HBTR; Temperature Range High: +85°C; Digikey Description: MEMS NANO PRESSURE SENSOR: 260-1; Device Class L2: Pressure Sensors; RoHS: TRUE; Lead Free: Yes; Height: 0.8mm; Automotive: No; Octopart: https://octopart.com/lps22hbtr-stmicroelectronics-51851131; Package: HLGA-10L-8479831; Temperature Range Low: -40°C; Category: IC; Temperature: -40°C to +85°C; ComponentLink2Description: Datasheet; ComponentLink2URL: https://www.st.com/resource/en/datasheet/lps22hb.pdf; Footprint Url: https://www.st.com/content/ccc/resource/technical/document/technical_note/73/17/9c/16/dd/96/4a/01/CD00134799.pdf/files/CD00134799.pdf/jcr:content/translations/en.CD00134799.pdf
U8 = CMP-08164-000002-1: SENSOR DIGITAL -40C-125C 6DFN; Manufacturer: Silicon Labs; Interface: I2C; Operating Supply Current: 0.06-3500uA; Standoff Height: 0mm; Max Supply Voltage: 3.6V; Resolution: 14bits; Min Supply Voltage: 1.9V; Ambient Temperature Range High: +125°C; Digikey Description: SENSOR DIGITAL -40C-125C 6DFN; Package: SI7051-A20-IM; Device Class L2: Temperature and Humidity Sensors; Temperature Range Low: -40°C; Manufacturer Part Number: SI7051-A20-IM; Device Class L3: unset; Octopart: https://octopart.com/si7051-a20-im-silicon+labs-71522607; Ambient Temperature Range Low: -40°C; Height: 0.8mm; RoHS: TRUE; ComponentLink2Description: Datasheet; Ipc Land Pattern Name: DFN300X300X75-6; Category: IC; ComponentLink2URL: https://www.silabs.com/documents/public/data-sheets/Si7050-1-3-4-5-A20.pdf; Sensor Output: I2C; Lead Free: Yes; Automotive: No; Temperature Range High: +125°C; Temperature: -40°C to +125°C; Device Class L1: Sensors
U9 = CMP-010-00026-1: SGP40 Series 3.6 V 4 mA Indoor Air Quality Sensor for VOC Measurements - DFN-6